# EAGLE schematic 808sn (EAGLE 7.1.0)
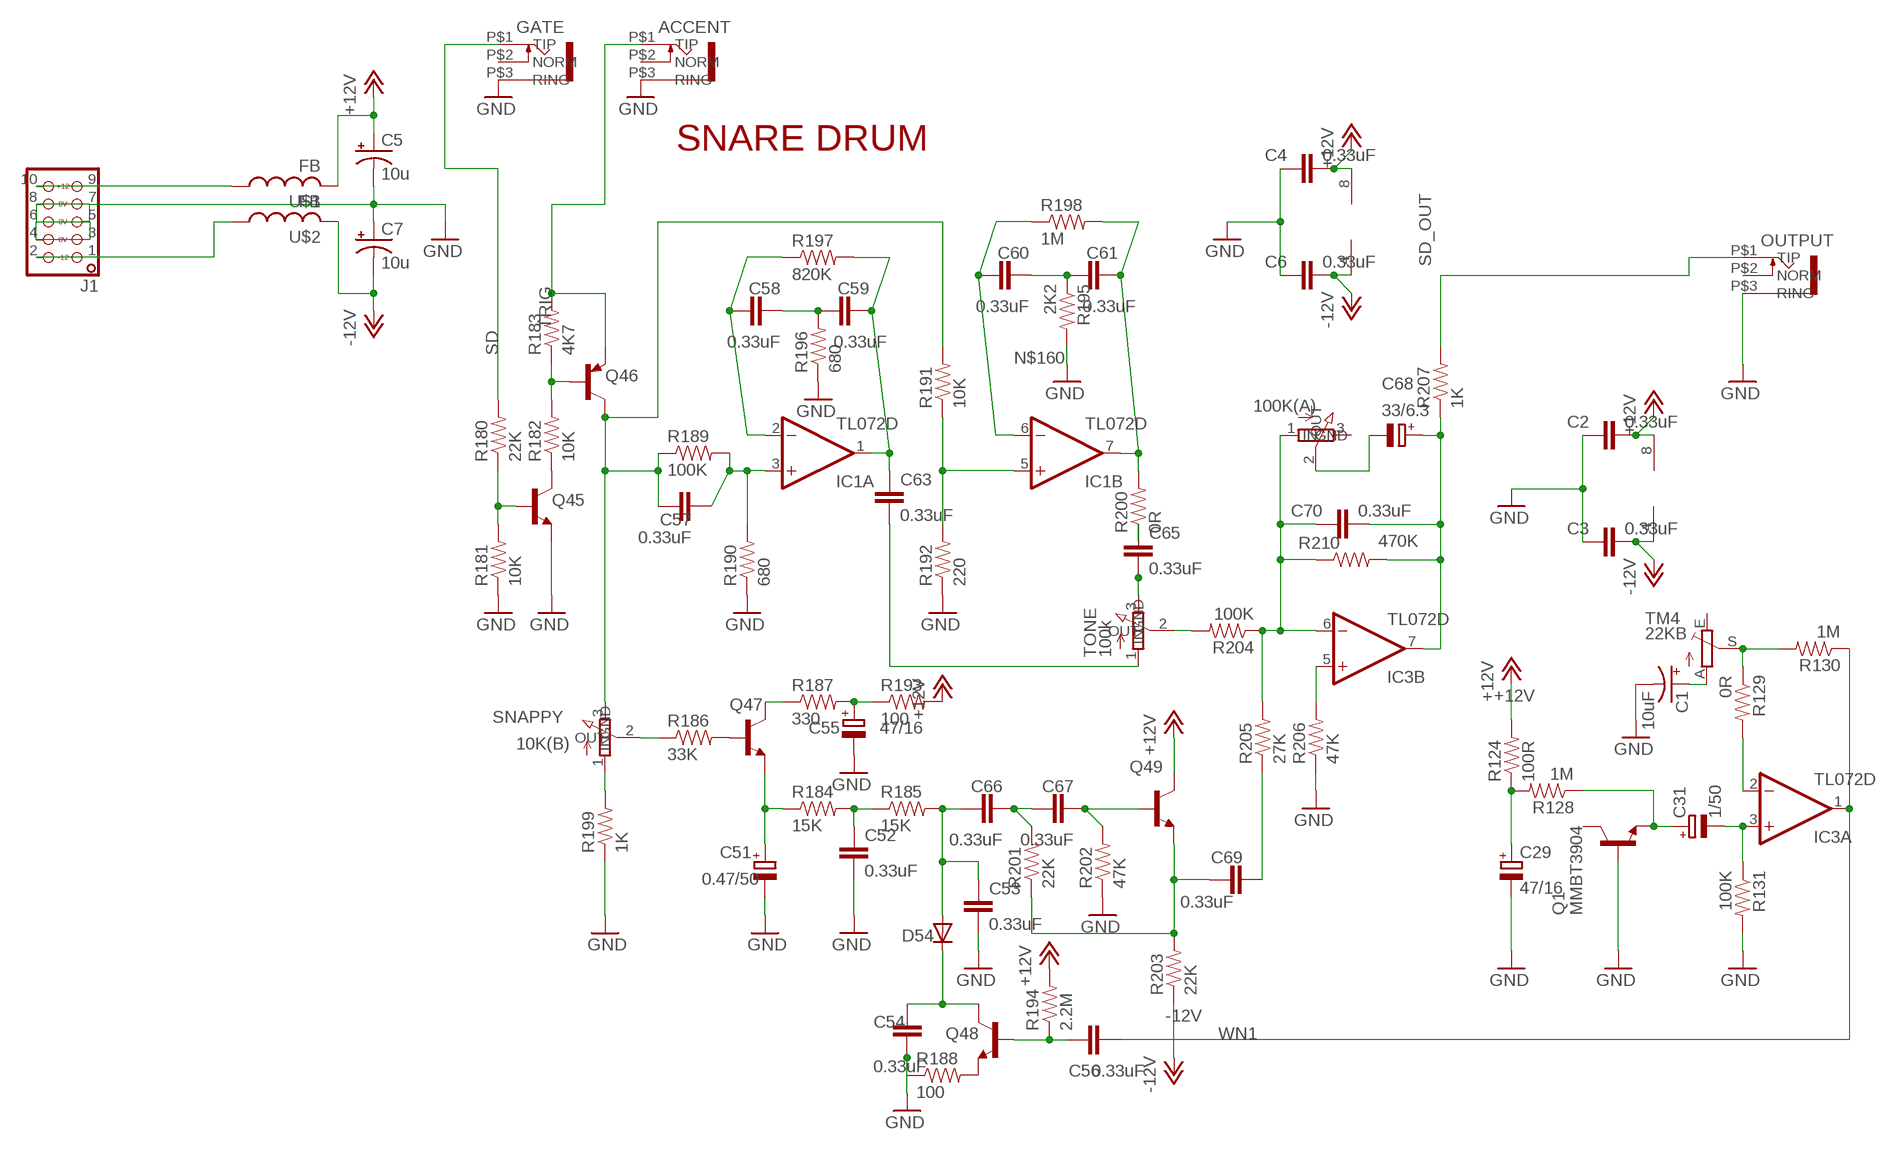
[diagram p0: schematic, sheet 1]

## Parts
ACCENT  VERTICALJACKS  [KOBICONN_PJM301DM_JACK]
C1  10uF  CPOL-USB45181A  [B45181A]
C2  0.33uF  CAPACITOR_0805_HAND  [0805-CAP]
C3  0.33uF  CAPACITOR_0805_HAND  [0805-CAP]
C4  0.33uF  CAPACITOR_0805_HAND  [0805-CAP]
C5  10u  CPOL-USB45181A  [B45181A]
C6  0.33uF  CAPACITOR_0805_HAND  [0805-CAP]
C7  10u  CPOL-USB45181A  [B45181A]
C29  47/16  CPOL-EUE2.5-5  [E2,5-5]
C31  1/50  CPOL-EUE3.5-8  [E3,5-8]
C51  0.47/50  CPOL-EUE3.5-8  [E3,5-8]
C52  0.33uF  CAPACITOR_0805_HAND  [0805-CAP]
C53  0.33uF  CAPACITOR_0805_HAND  [0805-CAP]
C54  0.33uF  CAPACITOR_0805_HAND  [0805-CAP]
C55  47/16  CPOL-EUE2-5  [E2-5]
C56  0.33uF  CAPACITOR_0805_HAND  [0805-CAP]
C57  0.33uF  CAPACITOR_0805_HAND  [0805-CAP]
C58  0.33uF  CAPACITOR_0805_HAND  [0805-CAP]
C59  0.33uF  CAPACITOR_0805_HAND  [0805-CAP]
C60  0.33uF  CAPACITOR_0805_HAND  [0805-CAP]
C61  0.33uF  CAPACITOR_0805_HAND  [0805-CAP]
C63  0.33uF  CAPACITOR_0805_HAND  [0805-CAP]
C65  0.33uF  CAPACITOR_0805_HAND  [0805-CAP]
C66  0.33uF  CAPACITOR_0805_HAND  [0805-CAP]
C67  0.33uF  CAPACITOR_0805_HAND  [0805-CAP]
C68  33/6.3  CPOL-EUE2-5  [E2-5]
C69  0.33uF  CAPACITOR_0805_HAND  [0805-CAP]
C70  0.33uF  CAPACITOR_0805_HAND  [0805-CAP]
D54  1N4148SOD-323  [SOD323W_INFINEON]
GATE  VERTICALJACKS  [KOBICONN_PJM301DM_JACK]
IC1  TL072D  [SO08]
IC3  TL072D  [SO08]
J1  EUROPWR_2X05-OPEN  [2X05_EUROPWR_OPEN]
LEVEL  100K(A)  PCB_POTS  [ALPHA_9MM_VERTICAL]
OUTPUT  VERTICALJACKS  [KOBICONN_PJM301DM_JACK]
Q1  MMBT3904  MMBT3904LT1-NPN-SOT23-BEC  [SOT23-BEC]
Q45  MMBT3904  MMBT3904LT1-NPN-SOT23-BEC  [SOT23-BEC]
Q46  MMBT3906  MMBT3906LT1-PNP-SOT23-BEC  [SOT23-BEC]
Q47  MMBT3904  MMBT3904LT1-NPN-SOT23-BEC  [SOT23-BEC]
Q48  MMBT3904  MMBT3904LT1-NPN-SOT23-BEC  [SOT23-BEC]
Q49  MMBT3904  MMBT3904LT1-NPN-SOT23-BEC  [SOT23-BEC]
R124  100R  RESISTOR_0805_HAND  [0805_RESISTOR]
R128  1M  RESISTOR_0805_HAND  [0805_RESISTOR]
R129  0R  RESISTOR_0805_HAND  [0805_RESISTOR]
R130  1M  RESISTOR_0805_HAND  [0805_RESISTOR]
R131  100K  RESISTOR_0805_HAND  [0805_RESISTOR]
R180  22K  RESISTOR_0805_HAND  [0805_RESISTOR]
R181  10K  RESISTOR_0805_HAND  [0805_RESISTOR]
R182  10K  RESISTOR_0805_HAND  [0805_RESISTOR]
R183  4K7  RESISTOR_0805_HAND  [0805_RESISTOR]
R184  15K  RESISTOR_0805_HAND  [0805_RESISTOR]
R185  15K  RESISTOR_0805_HAND  [0805_RESISTOR]
R186  33K  RESISTOR_0805_HAND  [0805_RESISTOR]
R187  330  RESISTOR_0805_HAND  [0805_RESISTOR]
R188  100  RESISTOR_0805_HAND  [0805_RESISTOR]
R189  100K  RESISTOR_0805_HAND  [0805_RESISTOR]
R190  680  RESISTOR_0805_HAND  [0805_RESISTOR]
R191  10K  RESISTOR_0805_HAND  [0805_RESISTOR]
R192  220  RESISTOR_0805_HAND  [0805_RESISTOR]
R193  100  RESISTOR_0805_HAND  [0805_RESISTOR]
R194  2.2M  RESISTOR_0805_HAND  [0805_RESISTOR]
R195  2K2  RESISTOR_0805_HAND  [0805_RESISTOR]
R196  680  RESISTOR_0805_HAND  [0805_RESISTOR]
R197  820K  RESISTOR_0805_HAND  [0805_RESISTOR]
R198  1M  RESISTOR_0805_HAND  [0805_RESISTOR]
R199  1K  RESISTOR_0805_HAND  [0805_RESISTOR]
R200  0R  RESISTOR_0805_HAND  [0805_RESISTOR]
R201  22K  RESISTOR_0805_HAND  [0805_RESISTOR]
R202  47K  RESISTOR_0805_HAND  [0805_RESISTOR]
R203  22K  RESISTOR_0805_HAND  [0805_RESISTOR]
R204  100K  RESISTOR_0805_HAND  [0805_RESISTOR]
R205  27K  RESISTOR_0805_HAND  [0805_RESISTOR]
R206  47K  RESISTOR_0805_HAND  [0805_RESISTOR]
R207  1K  RESISTOR_0805_HAND  [0805_RESISTOR]
R210  470K  RESISTOR_0805_HAND  [0805_RESISTOR]
SNAPPY  10K(B)  PCB_POTS  [ALPHA_9MM_VERTICAL]
TM4  22KB  TRIM_EU-B64Y  [B64Y]
TONE  100k  PCB_POTS  [ALPHA_9MM_VERTICAL]
U$1  FB  [FB]
U$2  FB  [FB]

## Nets
+12V: C2.2 C4.2 C5.+ IC1.8(P:V+) IC3.8(P:V+) Q49.C R124.2 R193.2 R194.2 U$1.P$2
-12V: C3.2 C6.2 C7.- IC1.4(P:V-) IC3.4(P:V-) R203.1 U$2.P$2
GND [GND]: ACCENT.P$3(RING) C1.- C2.1 C3.1 C4.1 C5.- C6.1 C7.+ C29.- C51.- C52.2 C53.2 C54.2 C55.- GATE.P$3(RING) J1.3 J1.4 J1.5 J1.6 J1.7 J1.8 OUTPUT.P$3(RING) Q1.B Q45.E R131.2 R181.1 R188.1 R190.1 R192.1 R195.2 R196.1 R199.1 R202.1 R206.1
N$1: IC3.5(B:+IN) R206.2
N$3: C1.+ TM4.A
N$4: IC3.2(A:-IN) R129.2
N$5: Q45.B R180.1 R181.2
N$6: Q46.B R182.2 R183.1
N$7: Q45.C R182.1
N$8: C57.2 IC1.3(A:+IN) R189.2 R190.2
N$9: C57.1 Q46.C R189.1 R191.2 SNAPPY.3(IN)
N$10: J1.9 J1.10 U$1.P$1
N$11: C58.1 IC1.2(A:-IN) R197.1
N$12: C59.2 C63.1 IC1.1(A:OUT) R197.2
N$13: C58.2 C59.1 R196.2
N$14: C61.2 IC1.7(B:OUT) R198.2 R200.2
N$15: C60.2 C61.1 R195.1
N$16: IC1.5(B:+IN) R191.1 R192.2
N$17: C63.2 TONE.1(GND)
N$18: C65.2 TONE.3(IN)
N$19: C65.1 R200.1
N$20: R199.2 SNAPPY.1(GND)
N$21: C52.1 R184.2 R185.1
N$22: R186.1 SNAPPY.2(OUT)
N$23: Q47.B R186.2
N$24: Q47.C R187.1
N$25: C55.+ R187.2 R193.1
N$26: C51.+ Q47.E R184.1
N$27: C53.1 C66.1 D54.A R185.2
N$28: C66.2 C67.1 R201.2
N$29: C67.2 Q49.B R202.2
N$30: C69.1 Q49.E R201.1 R203.2
N$31: Q48.E R188.2
N$32: C54.1 D54.C Q48.C
N$33: C56.1 Q48.B R194.1
N$34: R204.2 TONE.2(OUT)
N$35: C70.1 IC3.6(B:-IN) LEVEL.1(GND) R204.1 R205.2 R210.1
N$36: C69.2 R205.1
N$37: J1.1 J1.2 U$2.P$1
N$129: C68.+ C70.2 IC3.7(B:OUT) R207.1 R210.2
N$159: C68.- LEVEL.2(OUT)
N$160: C60.1 IC1.6(B:-IN) R198.1
N$280: C31.- IC3.3(A:+IN) R131.1
N$490: R129.1 R130.2 TM4.S
N$491: C31.+ Q1.E R128.1
N$492: C29.+ R124.1 R128.2
SD: GATE.P$1(TIP) R180.2
SD_OUT: OUTPUT.P$1(TIP) R207.2
TRIG: ACCENT.P$1(TIP) Q46.E R183.2
WN1: C56.2 IC3.1(A:OUT) R130.1
Unconnected: ACCENT.P$2(NORM) GATE.P$2(NORM) LEVEL.3(IN) OUTPUT.P$2(NORM) Q1.C TM4.E

## Notes on the sheet
- SNARE DRUM

## Library data of the parts
ACCENT GATE OUTPUT = 0000-master:VERTICALJACKS
C1 C5 C7 = rcl:CPOL-US: POLARIZED CAPACITOR, American symbol
C2-C4 C6 C52-C54 C56-C61 C63 C65-C67 C69 C70 = 0000-master:CAPACITOR_0805_HAND: CAP-08469; PROD_ID: CAP-08469
C29 C31 C51 C55 C68 = TR808clone:CPOL-EU: POLARIZED CAPACITOR, European symbol
D54 = 0000-master:1N4148: DIODE high speed (Philips)
IC1 IC3 = linear:TL072: OP AMP
J1 = 0000-master:EUROPWR_2X05: 2x05 pin header
LEVEL SNAPPY TONE = 0000-master:PCB_POTS: 9 mm Square Rotary Potentiometers Source: Panasonic
Q1 Q45 Q47-Q49 = transistor-neu-to92:*-NPN-: NPN Transistror
Q46 = transistor-neu-to92:*-PNP-: PNP Transistror
R124 R128-R131 R180-R207 R210 = 0000-master:RESISTOR_0805_HAND: RES-11622
TM4 = TR808clone:TRIM_EU-: POTENTIOMETER
U$1 U$2 = adafruit:FB: Ferrite bead Digikey #P9821BK-ND

## Net classes
1 GND: width 1.016 mm, drill 1.016 mm, clearance 0.508 mm
2 Power: width 1.016 mm, drill 1.016 mm, clearance 0.508 mm
3 special: width 0.635 mm, drill 0.254 mm, clearance 0.254 mm
4 15v: width 1.524 mm, drill 1.016 mm, clearance 0.508 mm